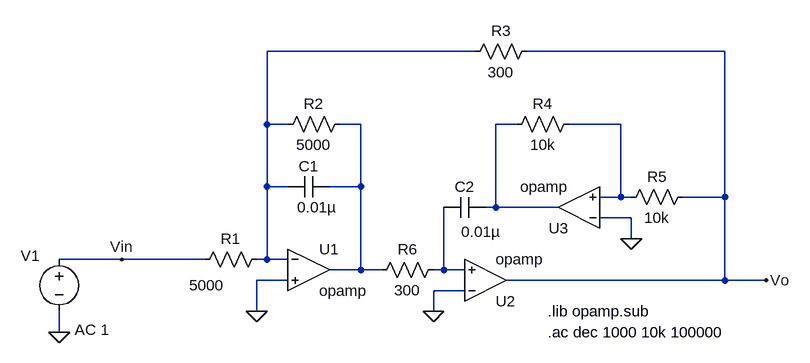
[diagram p0: schematic circuito.asc]
circuito.asc, the LTspice schematic file:
Version 4
SHEET 1 880 680
WIRE 288 -112 -32 -112
WIRE 672 -112 368 -112
WIRE -32 0 -32 -112
WIRE 0 0 -32 0
WIRE 112 0 80 0
WIRE 352 0 320 0
WIRE 512 0 432 0
WIRE -32 96 -32 0
WIRE 0 96 -32 96
WIRE 112 96 112 0
WIRE 112 96 64 96
WIRE 512 112 512 0
WIRE 512 112 480 112
WIRE 528 112 512 112
WIRE 672 112 672 -112
WIRE 672 112 608 112
WIRE 320 128 320 0
WIRE 320 128 304 128
WIRE 416 128 320 128
WIRE 528 144 480 144
WIRE 528 176 528 144
WIRE -256 208 -352 208
WIRE -128 208 -256 208
WIRE -32 208 -32 96
WIRE -32 208 -48 208
WIRE 0 208 -32 208
WIRE 112 224 112 96
WIRE 112 224 64 224
WIRE 144 224 112 224
WIRE 240 224 240 128
WIRE 240 224 224 224
WIRE 272 224 240 224
WIRE 0 240 -48 240
WIRE 672 240 672 112
WIRE 672 240 336 240
WIRE 736 240 672 240
WIRE 272 256 224 256
WIRE -48 288 -48 240
WIRE 224 288 224 256
WIRE -352 320 -352 288
FLAG 528 176 0
FLAG 224 288 0
FLAG -48 288 0
FLAG 736 240 Vo
FLAG -256 208 Vin
FLAG -352 320 0
SYMBOL OpAmps\\opamp 32 160 R0
SYMATTR InstName U1
SYMBOL OpAmps\\opamp 304 304 M180
SYMATTR InstName U2
SYMBOL OpAmps\\opamp 448 192 R180
SYMATTR InstName U3
SYMBOL res -32 192 R90
WINDOW 0 0 56 VBottom 2
WINDOW 3 40 93 VTop 2
SYMATTR InstName R1
SYMATTR Value 5000
SYMBOL res 96 -16 R90
WINDOW 0 0 56 VBottom 2
WINDOW 3 32 56 VTop 2
SYMATTR InstName R2
SYMATTR Value 5000
SYMBOL cap 64 80 R90
WINDOW 0 0 32 VBottom 2
WINDOW 3 32 19 VTop 2
SYMATTR InstName C1
SYMATTR Value 0.01µ
SYMBOL res 384 -128 R90
WINDOW 0 0 56 VBottom 2
WINDOW 3 32 56 VTop 2
SYMATTR InstName R3
SYMATTR Value 300
SYMBOL res 448 -16 R90
WINDOW 0 0 56 VBottom 2
WINDOW 3 32 56 VTop 2
SYMATTR InstName R4
SYMATTR Value 10k
SYMBOL res 624 96 R90
WINDOW 0 0 56 VBottom 2
WINDOW 3 32 56 VTop 2
SYMATTR InstName R5
SYMATTR Value 10k
SYMBOL cap 304 112 R90
WINDOW 0 0 32 VBottom 2
WINDOW 3 38 7 VTop 2
SYMATTR InstName C2
SYMATTR Value 0.01µ
SYMBOL res 240 208 R90
WINDOW 0 0 56 VBottom 2
WINDOW 3 32 56 VTop 2
SYMATTR InstName R6
SYMATTR Value 300
SYMBOL voltage -352 192 R0
WINDOW 123 24 124 Left 2
WINDOW 39 0 0 Left 0
WINDOW 0 -59 10 Left 2
SYMATTR Value2 AC 1
SYMATTR InstName V1
SYMATTR Value ""
TEXT 400 288 Left 2 !.lib opamp.sub
TEXT 400 320 Left 2 !.ac dec 1000 10k 100000

The netlist it stands for:
* circuito.asc
XU1 N001 0 N002 opamp Aol=100K GBW=10Meg  ; pins invin noninvin out
XU2 0 N005 Vo opamp Aol=100K GBW=10Meg  ; pins invin noninvin out
XU3 0 N004 N003 opamp Aol=100K GBW=10Meg  ; pins invin noninvin out
R1 N001 Vin 5000
R2 N002 N001 5000
C1 N002 N001 0.01µ
R3 Vo N001 300
R4 N004 N003 10k
R5 Vo N004 10k
C2 N003 N005 0.01µ
R6 N005 N002 300
V1 Vin 0 AC 1
.lib opamp.sub
.ac dec 1000 10k 100000
.backanno
.end

* Results of the author's LTspice run, read from the files saved beside the schematic
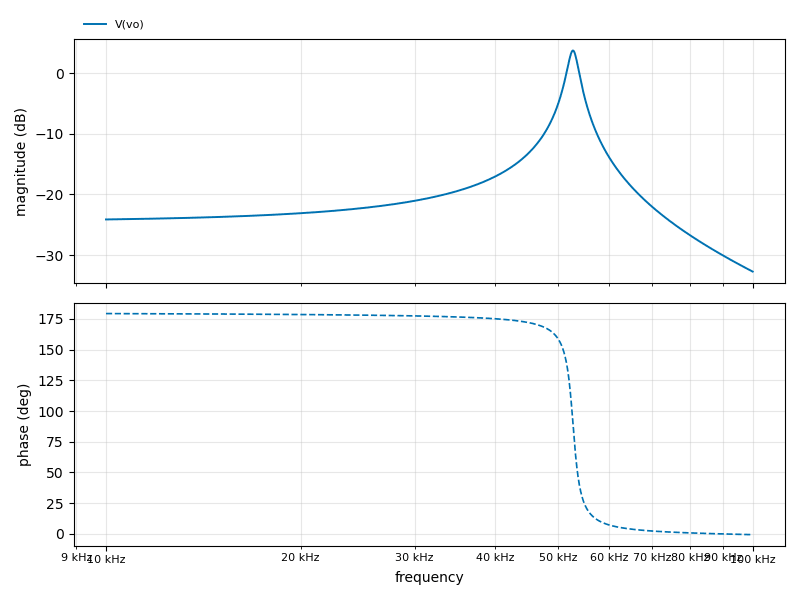
[diagram p1: AC Analysis of circuito.asc, plotted from the saved traces]
* AC Analysis, 1 run:
*   V(vo): -24.12 dB at 10 kHz, -32.72 dB at 100 kHz, peak 3.74 dB at 52.72 kHz, 3 dB below the peak at 51.7 kHz and 53.76 kHz